# EAGLE design main (EAGLE 7.6.0)
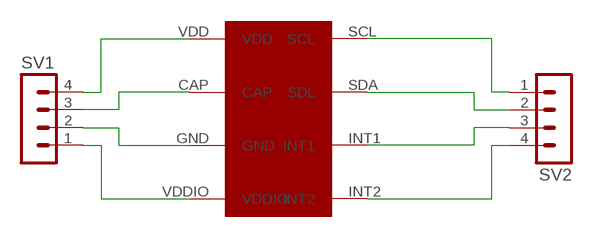
[diagram p0: schematic, sheet 1]

## Parts
SV1  MA04-1  [MA04-1]
SV2  MA04-1  [MA04-1]
U$1  MPL3115A2  [LGA8_CAN]

## Nets
N$1: SV1.4 U$1.VDD
N$2: SV1.3 U$1.CAP
N$3: SV1.2 U$1.GND
N$4: SV1.1 U$1.VDDIO
N$5: SV2.4 U$1.INT2
N$6: SV2.3 U$1.INT1
N$7: SV2.2 U$1.SDA(SDL)
N$8: SV2.1 U$1.SCL

## Library data of the parts
SV1 SV2 = con-lstb:MA04-1: PIN HEADER; OC_FARNELL: unknown; OC_NEWARK: unknown
U$1 = 7_segment_lib:MPL3115A2

## Board
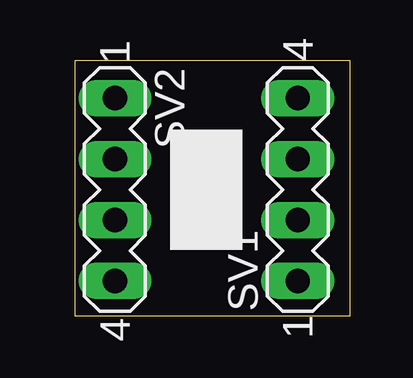
[diagram p1: board, top side]
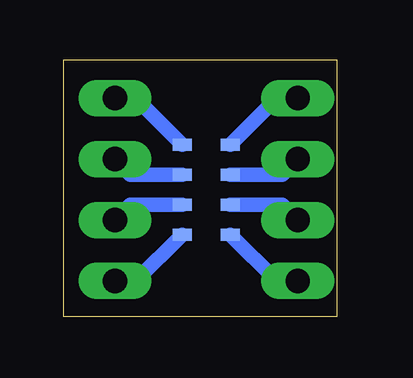
[diagram p2: board, bottom side, seen from below]

Size 11.43 x 10.67 mm. Coordinates in mm from the lower left corner, seen from the top.
Outline: 0,10.67 11.43,10.67 11.43,0 0,0 0,10.67
Copper layers (1*16): Top 0.035mm / dielectric 1.5mm / Bottom 0.035mm
Design rules "default": minimum track width 10mil, minimum drill 24mil, track to track 8mil, track to pad 8mil, pad to pad 8mil, via to via 8mil, smd to smd 8mil, copper to edge 40mil, drill to drill 8mil, minimum pad ring 10mil, minimum via ring 8mil, stop-mask expansion 4mil, vias tented up to drill 0mil, thermal gap 10mil

### Footprints (pad centres in the part's own frame; a part is rotated, then mirrored left to right if it is on the bottom)
MA04-1 = drill 1.016 long: 1 -3.81,0; 2 -1.27,0; 3 1.27,0; 4 3.81,0
LGA8_CAN = smd 0.8 x 0.5 bottom: CAP 1,0.625; GND 1,-0.625; INT1 -1,-0.625; INT2 -1,-1.875; SCL -1,1.875; SDA -1,0.625; VDD 1,1.875; VDDIO 1,-1.875

### Placement (x,y rotation side)
SV1  9.27,5.27 90 top
SV2  1.65,5.27 270 top
U$1  5.46,5.27 0 top

### Tracks (layer width: path | path; a pad name or v marks a point on that pad's centre or on a via)
N$1
  Bottom 0.61: SV1.4 8.4,9.08 U$1.VDD
N$2
  Bottom 0.61: SV1.3 8.63,5.9 U$1.CAP
N$3
  Bottom 0.61: SV1.2 8.63,4.65 U$1.GND
N$4
  Bottom 0.61: SV1.1 8.4,1.46 U$1.VDDIO
N$5
  Bottom 0.61: SV2.4 2.53,1.46 U$1.INT2
N$6
  Bottom 0.61: U$1.INT1 2.3,4.65 SV2.3
N$7
  Bottom 0.61: U$1.SDA 2.3,5.9 SV2.2
N$8
  Bottom 0.61: SV2.1 2.53,9.08 U$1.SCL